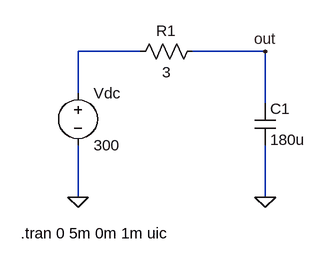
[diagram p0: schematic Cap_Charge.asc]
Cap_Charge.asc, the LTspice schematic file:
Version 4
SHEET 1 880 680
WIRE 128 48 32 48
WIRE 320 48 208 48
WIRE 32 112 32 48
WIRE 320 128 320 48
WIRE 32 272 32 192
WIRE 320 272 320 192
FLAG 32 272 0
FLAG 320 272 0
FLAG 320 48 out
SYMBOL voltage 32 96 R0
WINDOW 123 0 0 Left 2
WINDOW 39 0 0 Left 2
SYMATTR InstName Vdc
SYMATTR Value 300
SYMBOL res 224 32 R90
WINDOW 0 0 56 VBottom 2
WINDOW 3 32 56 VTop 2
SYMATTR InstName R1
SYMATTR Value 3
SYMBOL cap 304 128 R0
SYMATTR InstName C1
SYMATTR Value 180u
SYMATTR SpiceLine V=400 Rser=0.36
TEXT -56 328 Left 2 !.tran 0 5m 0m 1m uic

The netlist it stands for:
* Cap_Charge.asc
Vdc N001 0 300
R1 out N001 3
C1 out 0 180u V=400 Rser=0.36
.tran 0 5m 0m 1m uic
.backanno
.end